# EAGLE design activ_inductor (EAGLE 7.2.0)
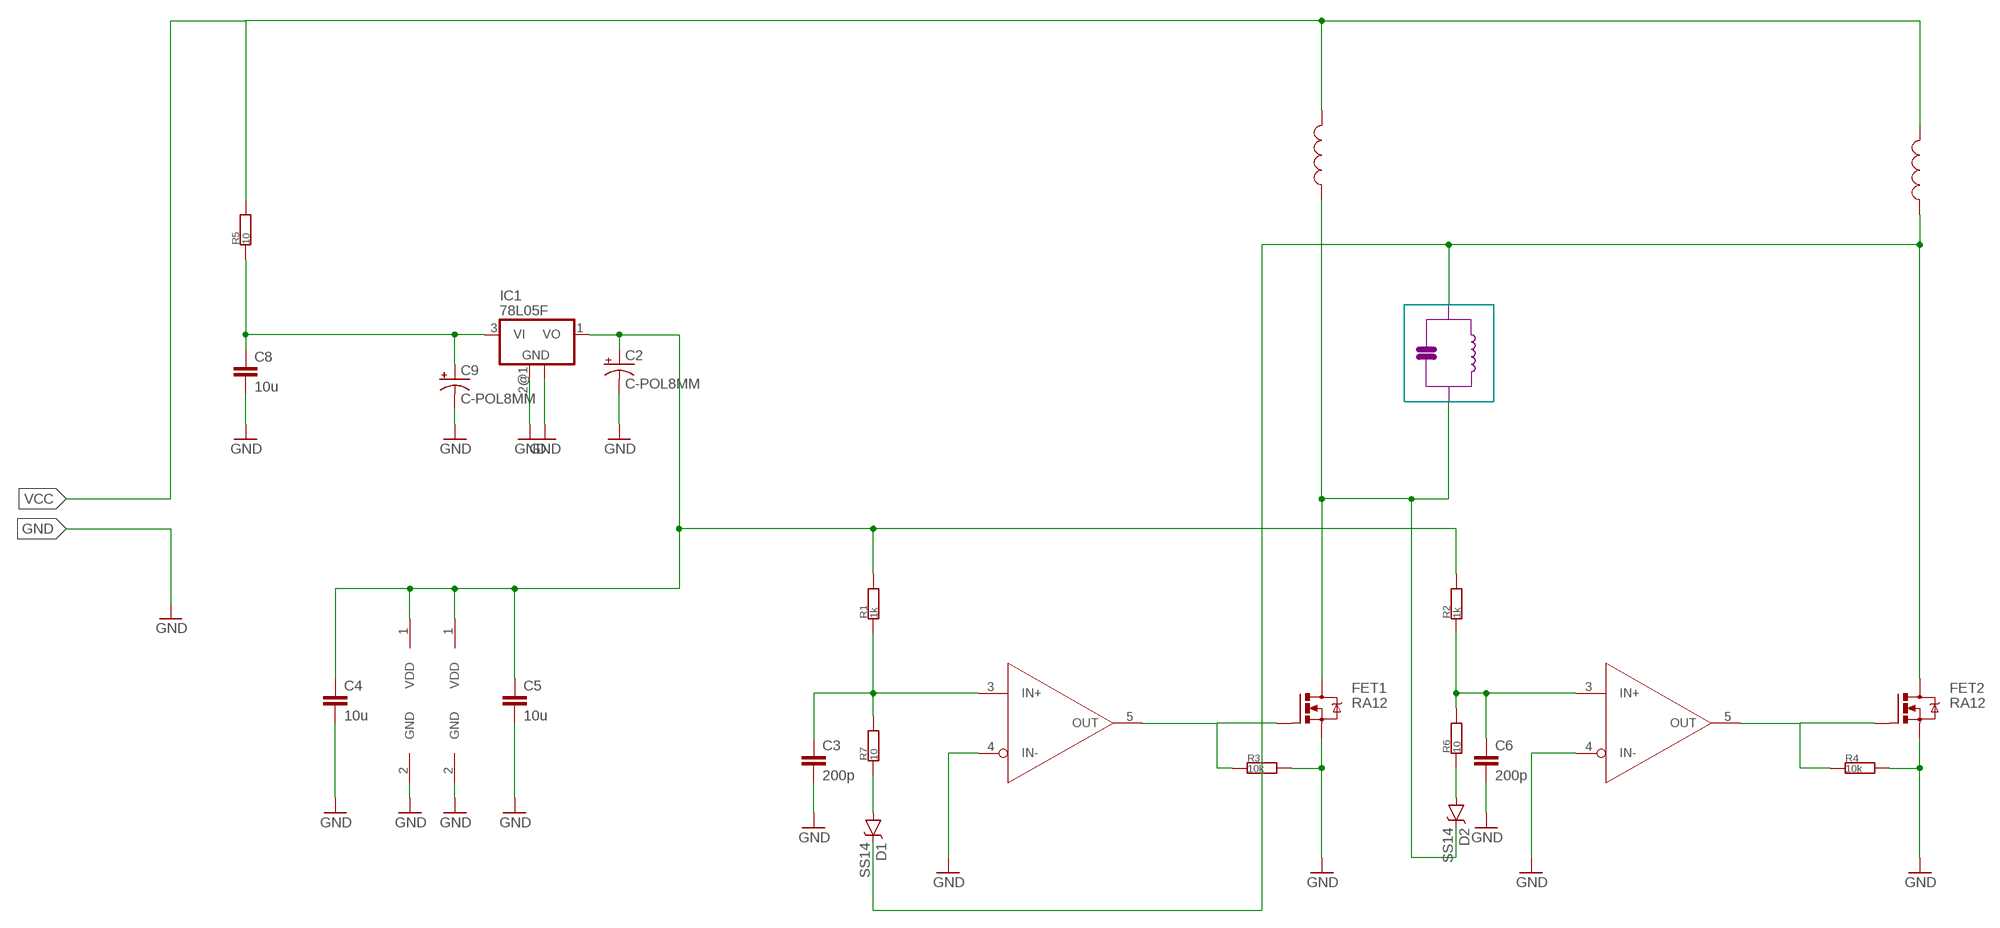
[diagram p0: schematic, sheet 1]

## Parts
C2  C-POL8MM  [PCAP8]
C3  200p  CC0805  [C0805]
C4  10u  CC0805  [C0805]
C5  10u  CC0805  [C0805]
C6  200p  CC0805  [C0805]
C8  10u  CC0805  [C0805]
C9  C-POL8MM  [PCAP8]
D1  SS14  [SMA-DIODE]
D2  SS14  [SMA-DIODE]
FET1  RA12  [POWERPAK_SO8]
FET2  RA12  [POWERPAK_SO8]
IC1  78L05F  [SOT89]
R1  1k  R0805  [R0805]
R2  1k  R0805  [R0805]
R3  10k  R0805  [R0805]
R4  10k  R0805  [R0805]
R5  10  R1206  [R1206]
R6  10  R0805  [R0805]
R7  10  R0805  [R0805]
U$1  FAN3100  [SOT23-5]
U$2  FAN3100  [SOT23-5]
U$4  INDUCTORRING_1  [INDUCTOR]
U$5  INDUCTORRING_1  [INDUCTOR]

## Nets
GND: C2.P$2(-) C3.2 C4.2 C5.2 C6.2 C8.2 C9.P$2(-) FET1.1(S) FET1.2(S) FET1.3(S) FET2.1(S) FET2.2(S) FET2.3(S) IC1.2(GND) IC1.2@1(GND) R3.2 R4.2 U$1.2(GND) U$1.4(IN-) U$2.2(GND) U$2.4(IN-)
N$1: D2.A R6.1
N$2: FET2.4(G) R4.1 U$2.5(OUT)
N$3: D1.A R7.1
N$5: C3.1 R1.1 R7.2 U$1.3(IN+)
N$6: C6.1 R2.1 R6.2 U$2.3(IN+)
N$8: C8.1 C9.P$1(+) IC1.3(VI) R5.1
N$9: C2.P$1(+) C4.1 C5.1 IC1.1(VO) R1.2 R2.2 U$1.1(VDD) U$2.1(VDD)
N$10: FET1.4(G) R3.1 U$1.5(OUT)
PHA: D2.C FET1.5(D) FET1.6(D) FET1.7(D) FET1.8(D) FET1.P$1(D) U$5.1
PHB: D1.C FET2.5(D) FET2.6(D) FET2.7(D) FET2.8(D) FET2.P$1(D) U$4.1
VCC: R5.2 U$4.2 U$5.2

## Library data of the parts
C2 C9 = CasaLibrary:C-POL
C3-C6 C8 = CasaLibrary:C: Capacitor
D1 D2 = CasaLibrary:SS14
FET1 FET2 = CasaLibrary:RA12
IC1 = linear:78L*: POSITOIV-VOLTAGE REGULATORS Output up to 100 mA Source: Datasheet <http://focus.ti.com/lit/ds/symlink/ua78l05.pdf>
R1-R7 = CasaLibrary:R
U$1 U$2 = CasaLibrary:FAN3100
U$4 U$5 = CasaLibrary:INDUCTOR

## Board
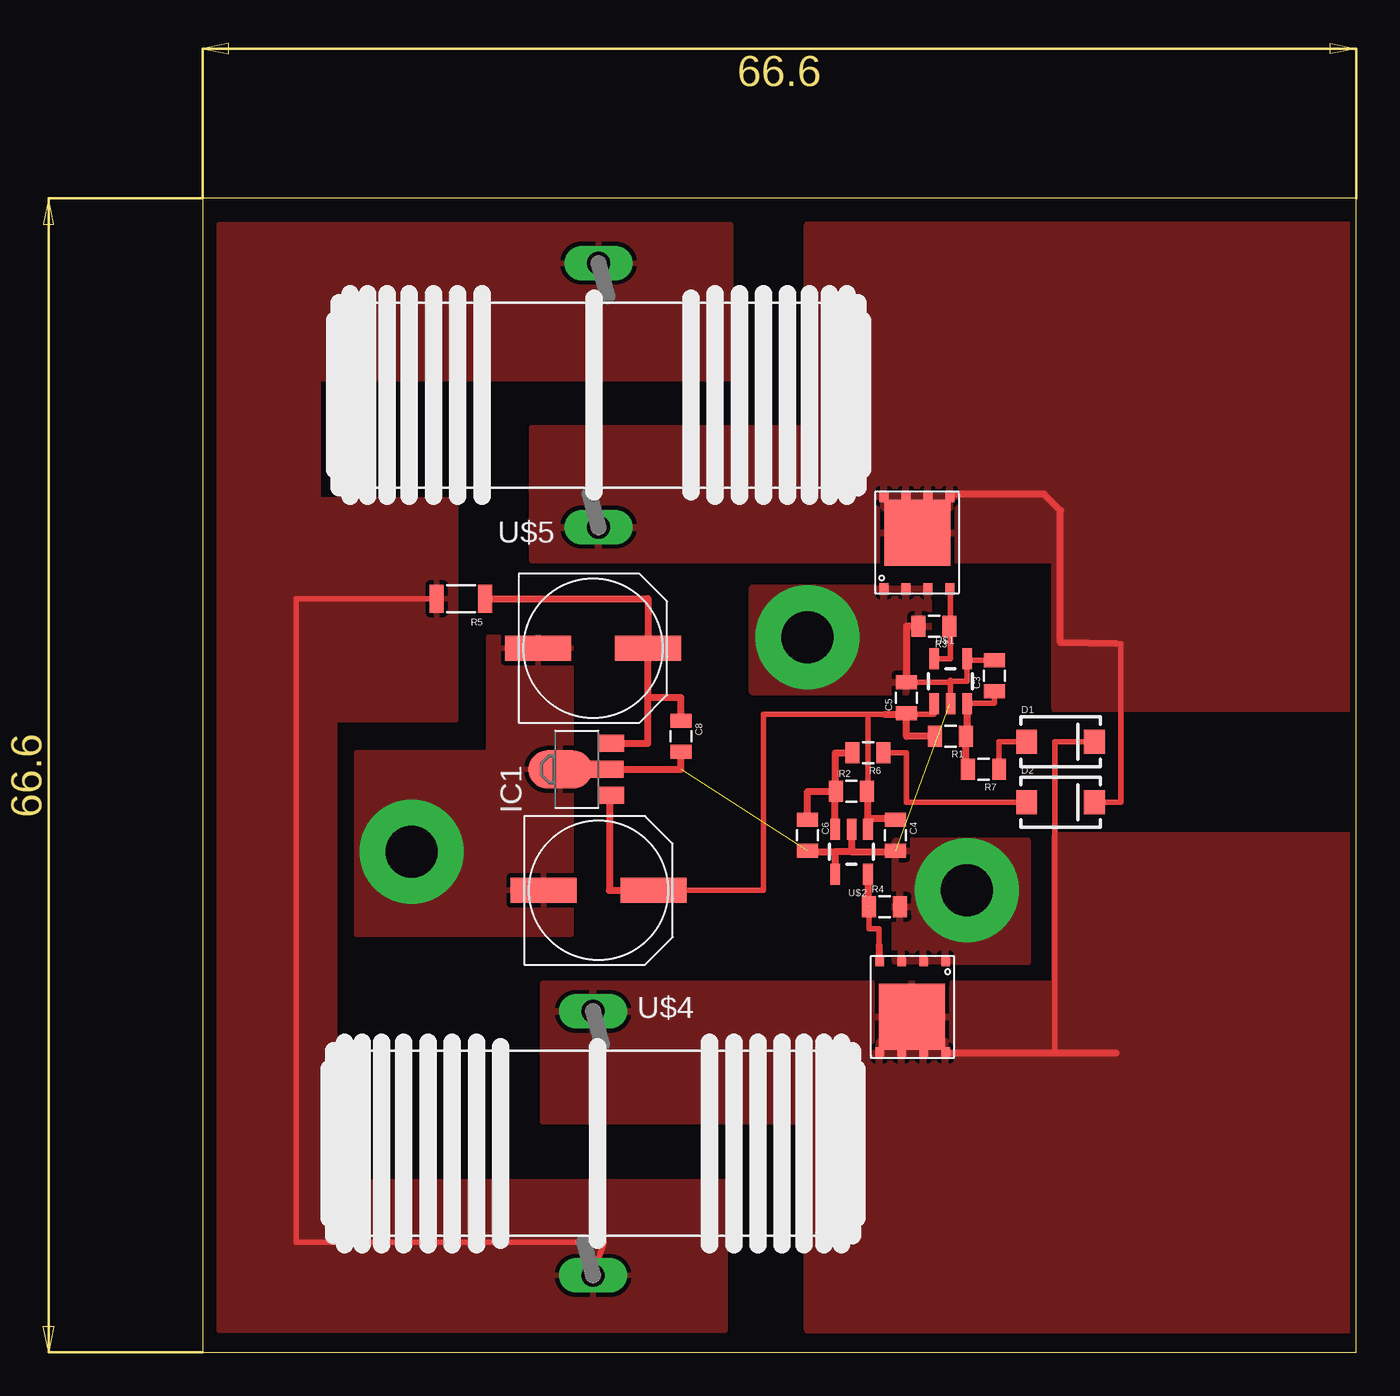
[diagram p1: board, top side]

Size 66.6 x 66.6 mm. Coordinates in mm from the lower left corner, seen from the top.
Outline: 0,0 66.6,0 66.6,66.6 0,66.6 0,0
Copper layers (1*16): Top 0.035mm / dielectric 1.5mm / Bottom 0.035mm
Design rules "default *": minimum track width 0.2mm, minimum drill 0.2mm, track to track 0.35mm, track to pad 0.35mm, pad to pad 0.35mm, via to via 0.2mm, smd to smd 0.35mm, copper to edge 0.35mm, drill to drill 0.2mm, minimum pad ring 10mil, minimum via ring 8mil, stop-mask expansion 4mil, vias tented up to drill 0mil, thermal gap 10mil

### Footprints (pad centres in the part's own frame; a part is rotated, then mirrored left to right if it is on the bottom)
PCAP8 = smd 3.8 x 1.46: P$1 -3.175,0; P$2 3.175,0
C0805 = smd 0.8 x 1.2: 1 -0.9,0; 2 0.9,0
SMA-DIODE = smd 1.2 x 1.4: A -1.95,0; C 1.95,0
POWERPAK_SO8 = smd 0.66 x 0.5: 1 -2.603,1.937; 2 -2.603,0.667; 3 -2.603,-0.603; 4 -2.603,-1.873; 5 2.731,-1.873; 6 2.731,-0.603; 7 2.731,0.667; 8 2.731,1.937 | smd 3.81 x 3.81: P$1 0.635,0
SOT89 = smd 1 x 1.5: 1 -1.499,-1.981; 3 1.499,-1.981 | smd 1 x 2: 2 0,-1.727 | smd 2.2 x 3.7: 2@1 0,0.94
R0805 = smd 0.8 x 1.2: 1 -0.9,0; 2 0.9,0
R1206 = smd 0.8 x 1.6: 1 -1.4,0; 2 1.4,0
SOT23-5 = smd 0.55 x 1.2: 1 -0.95,-1.3; 2 0,-1.3; 3 0.95,-1.3; 4 0.95,1.3; 5 -0.95,1.3
INDUCTOR = drill 1.321 long: 1 -7.62,0; 2 7.62,0

### Placement (x,y rotation side)
C2  22.86,26.67 180 top
C3  45.72,39.05 90 top
C4  40.01,29.84 270 top
C5  40.64,37.78 90 top
C6  34.92,29.84 270 top
C8  27.62,35.56 270 top
C9  22.54,40.64 180 top
D1  49.53,35.24 0 top
D2  49.53,31.75 0 top
FET1  41.27,46.67 90 top
FET2  40.96,20 270 top
IC1  21.59,33.66 90 top
R1  43.18,35.56 180 top
R2  37.47,32.38 0 top
R3  42.23,41.91 180 top
R4  39.37,25.72 0 top
R5  14.92,43.5 180 top
R6  38.42,34.61 180 top
R7  45.09,33.66 180 top
U$1  43.18,38.73 0 top
U$2  37.47,28.89 180 top
U$4  22.54,12.06 270 top
U$5  22.86,55.24 90 top

### Tracks (layer width: path | path; a pad name or v marks a point on that pad's centre or on a via)
GND  (via drill 3 pad 6)  (2 unrouted)
  Top 0.305: U$1.2 43.18,38.68 C5.2 | 43.18,38.73 44.13,38.73 U$1.4 | C3.2 44.13,39.95 | 40.01,25.72 R4.2
  Top 0.406: U$1.4 44.13,40.01 | 43.13,37.44 U$1.2 | 37.47,28.89 36.51,28.89 | 36.51,28.89 36.51,27.62 | 36.51,27.62 U$2.4 36.52,27.62 36.51,27.62 | U$2.2 37.47,28.89 | U$1.4 | 43.18,38.68 43.18,38.73 | R3.2 40.64,41.91 C5.2 | 37.47,28.89 40.01,28.89 C4.2 | 44.13,39.95 U$1.4 | C6.2 34.92,28.89 36.51,28.89 | IC1.2@1 IC1.2 27.62,33.66 C8.2
  other vias: 44.13,26.67 34.92,41.27 12.06,28.89
  pour Top (isolate 0.4): 31.75,44.13 41.91,44.13 41.91,41.59 40.64,41.59 40.64,38.1 31.75,38.1
  pour Top: 40.01,29.53 47.62,29.53 47.62,22.54 40.01,22.54
  pour Top: 8.89,34.61 8.89,24.13 21.27,24.13 21.27,41.27 16.51,41.27 16.51,34.61
N$1
  Top 0.305: R6.1 40.64,34.61 40.64,31.75 D2.A
N$2  (1 unrouted)
  Top 0.305: 39.05,22.64 FET2.4 | 39.05,23.5 39.05,24.45 38.47,24.45 R4.1
  Top 0.406: U$2.5 38.41,25.72 | 39.05,23.5 39.05,22.64
N$3
  Top 0.305: D1.A 45.98,35.24 R7.1
N$5
  Top 0.305: C3.1 45.72,37.47 44.13,37.47 | R7.2 44.08,33.92
  Top 0.406: U$1.3 44.13,35.24 R1.1 44.08,33.92 | U$1.3 | 44.13,37.47 U$1.3
N$6
  Top 0.406: U$2.3 36.52,32.38 | 36.52,32.38 R2.1 36.51,32.38 36.51,34.61 R6.2 | C6.1 34.92,32.38 36.52,32.38
N$8
  Top 0.406: R5.1 25.72,43.5 C9.P$1 25.72,37.78 | IC1.3 25.72,35.15 25.72,37.78 | C8.1 27.62,37.78 25.72,37.78
N$9
  Top 0.305: U$1.1 42.23,36.83 40.64,36.83 | 38.42,36.83 32.38,36.83 32.38,26.67 C2.P$1 | 38.42,36.83 40.01,36.83 | 38.41,32.38 38.41,36.83 38.42,36.83
  Top 0.406: 42.28,37.44 U$1.1 | U$2.1 38.41,30.8 | 38.41,30.8 38.41,32.38 R2.2 | C5.1 40.64,36.83 40.64,35.56 R1.2 | 38.41,30.8 40.01,30.8 C4.1 | 23.5,32.16 23.5,26.67 C2.P$1 27.3,26.67 | 39.37,36.83 40.01,36.83 40.59,36.83
  Top 0.61: 40.59,36.83 C5.1 | IC1.1 23.5,32.16
N$10
  Top 0.305: U$1.5 43.18,40.03 43.18,41.91 | 43.18,41.91 43.18,44.07 | R3.1 43.18,41.91
  Top 0.406: FET1.4 43.18,44.07
PHA
  Top 0.305: D2.C 53.02,31.75 53.02,40.91 52.75,40.91
  Top 0.406: 52.75,40.91 49.53,40.96 49.53,48.58 48.58,49.53 43.27,49.53 FET1.5
  pour Top: 19.05,53.34 34.92,53.34 34.92,65.09 66.6,65.09 66.6,37.15 49.21,37.15 49.21,45.72 19.05,45.72
PHB
  Top 0.305: D1.C 49.21,35.24 49.21,17.27
  Top 0.406: 52.75,17.27 49.21,17.27 FET2.8
  pour Top: 49.21,21.27 49.21,29.84 66.6,29.84 66.6,1.27 34.92,1.27 34.92,13.34 19.68,13.34 19.68,21.27
VCC
  Top 0.305: U$4.2 23.18,6.35 5.4,6.35 5.4,43.5 R5.2
  pour Top: 6.67,56.2 30.48,56.2 30.48,65.09 0.95,65.09 0.95,1.27 30.16,1.27 30.16,9.84 7.62,9.84 7.62,36.51 14.61,36.51 14.61,49.21 6.67,49.21